# Altium schematic sheet altium_hier_mcu.SchDoc
size A4
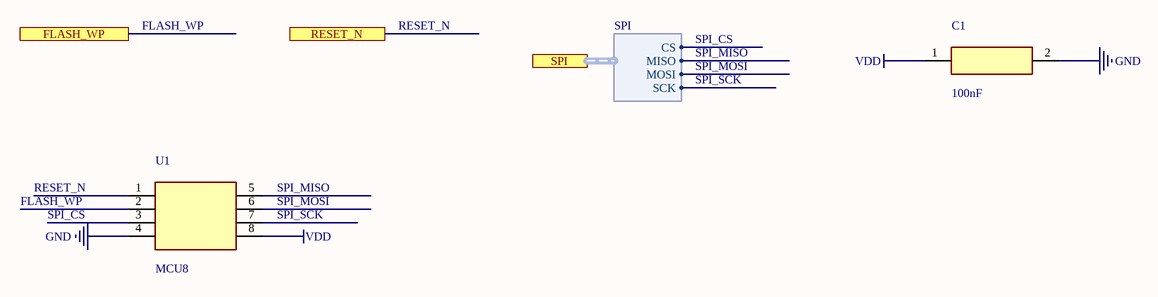
[diagram p0: altium_hier_mcu.SchDoc]

## Parts
C1  100nF  [C0603]
U1  MCU8  [SOIC8]

## Ports
FLASH_WP, RESET_N, SPI (harness SPI)

## Harnesses
SPI: CS, MISO, MOSI, SCK

## Nets
GND: C1.2 U1.4
VDD: C1.1 U1.8
FLASH_WP: U1.2 ; port FLASH_WP
RESET_N: U1.1 ; port RESET_N
SPI_CS: U1.3 ; port SPI.CS
SPI_MISO: U1.5 ; port SPI.MISO
SPI_MOSI: U1.6 ; port SPI.MOSI
SPI_SCK: U1.7 ; port SPI.SCK

## Library data of the parts
C1 = CAP